# EAGLE schematic icyradio (EAGLE 9.5.1), part 2 of 2
## Sheet 10 of 10: Power
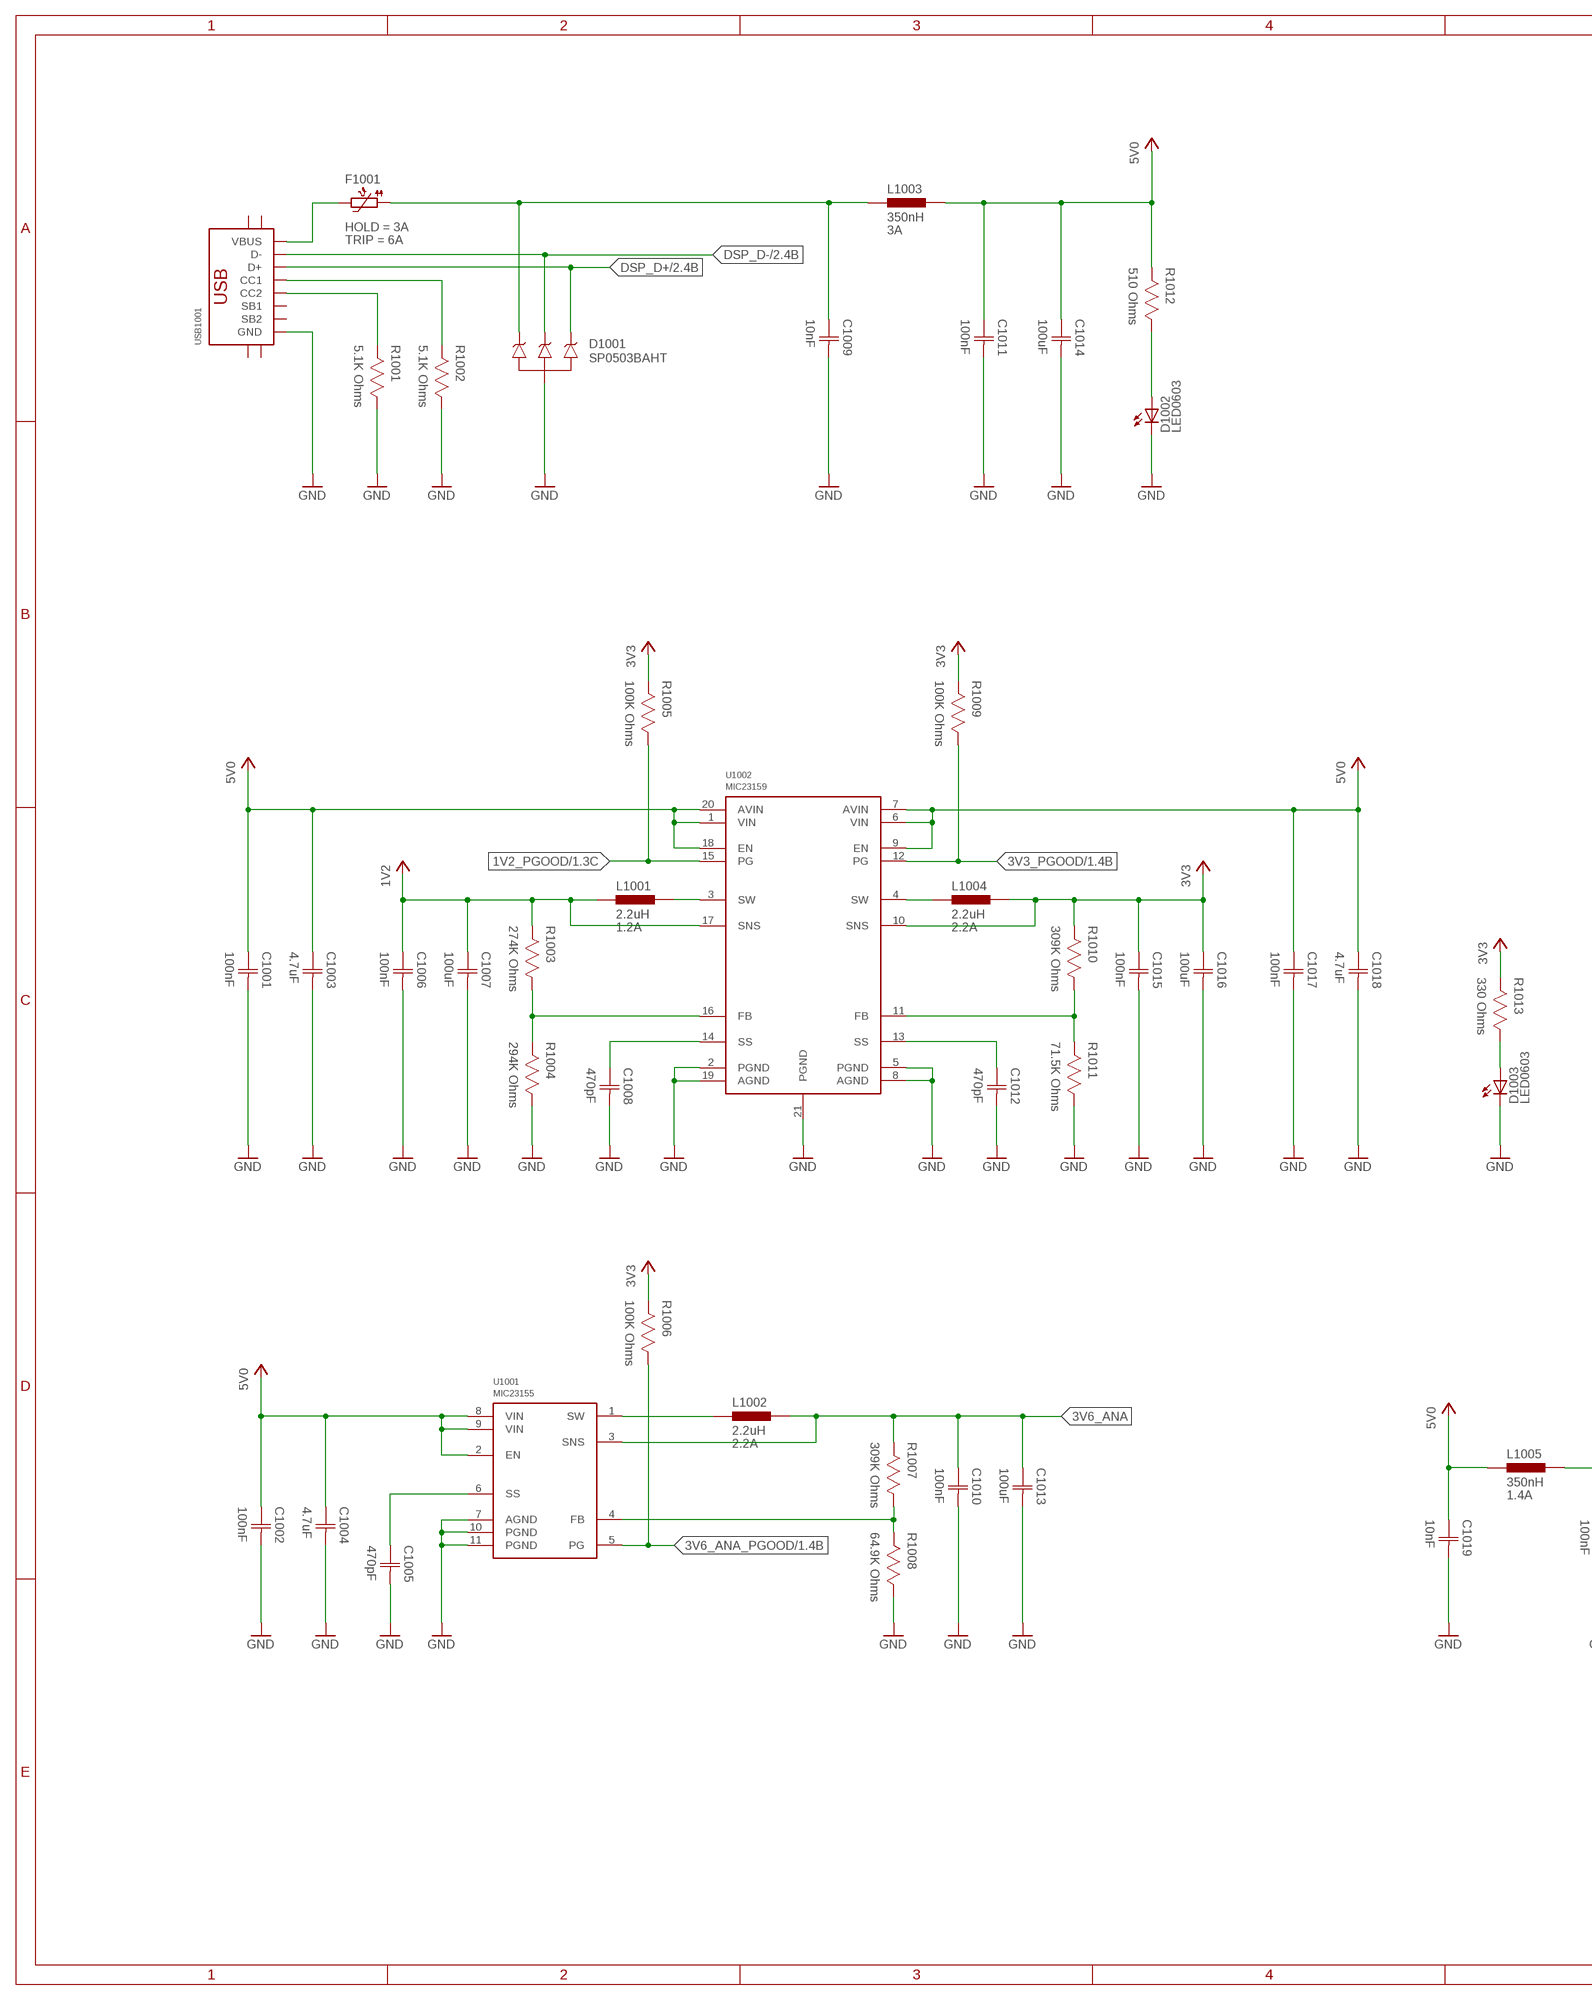
[diagram p18: schematic, sheet 10, part 1 of 2]
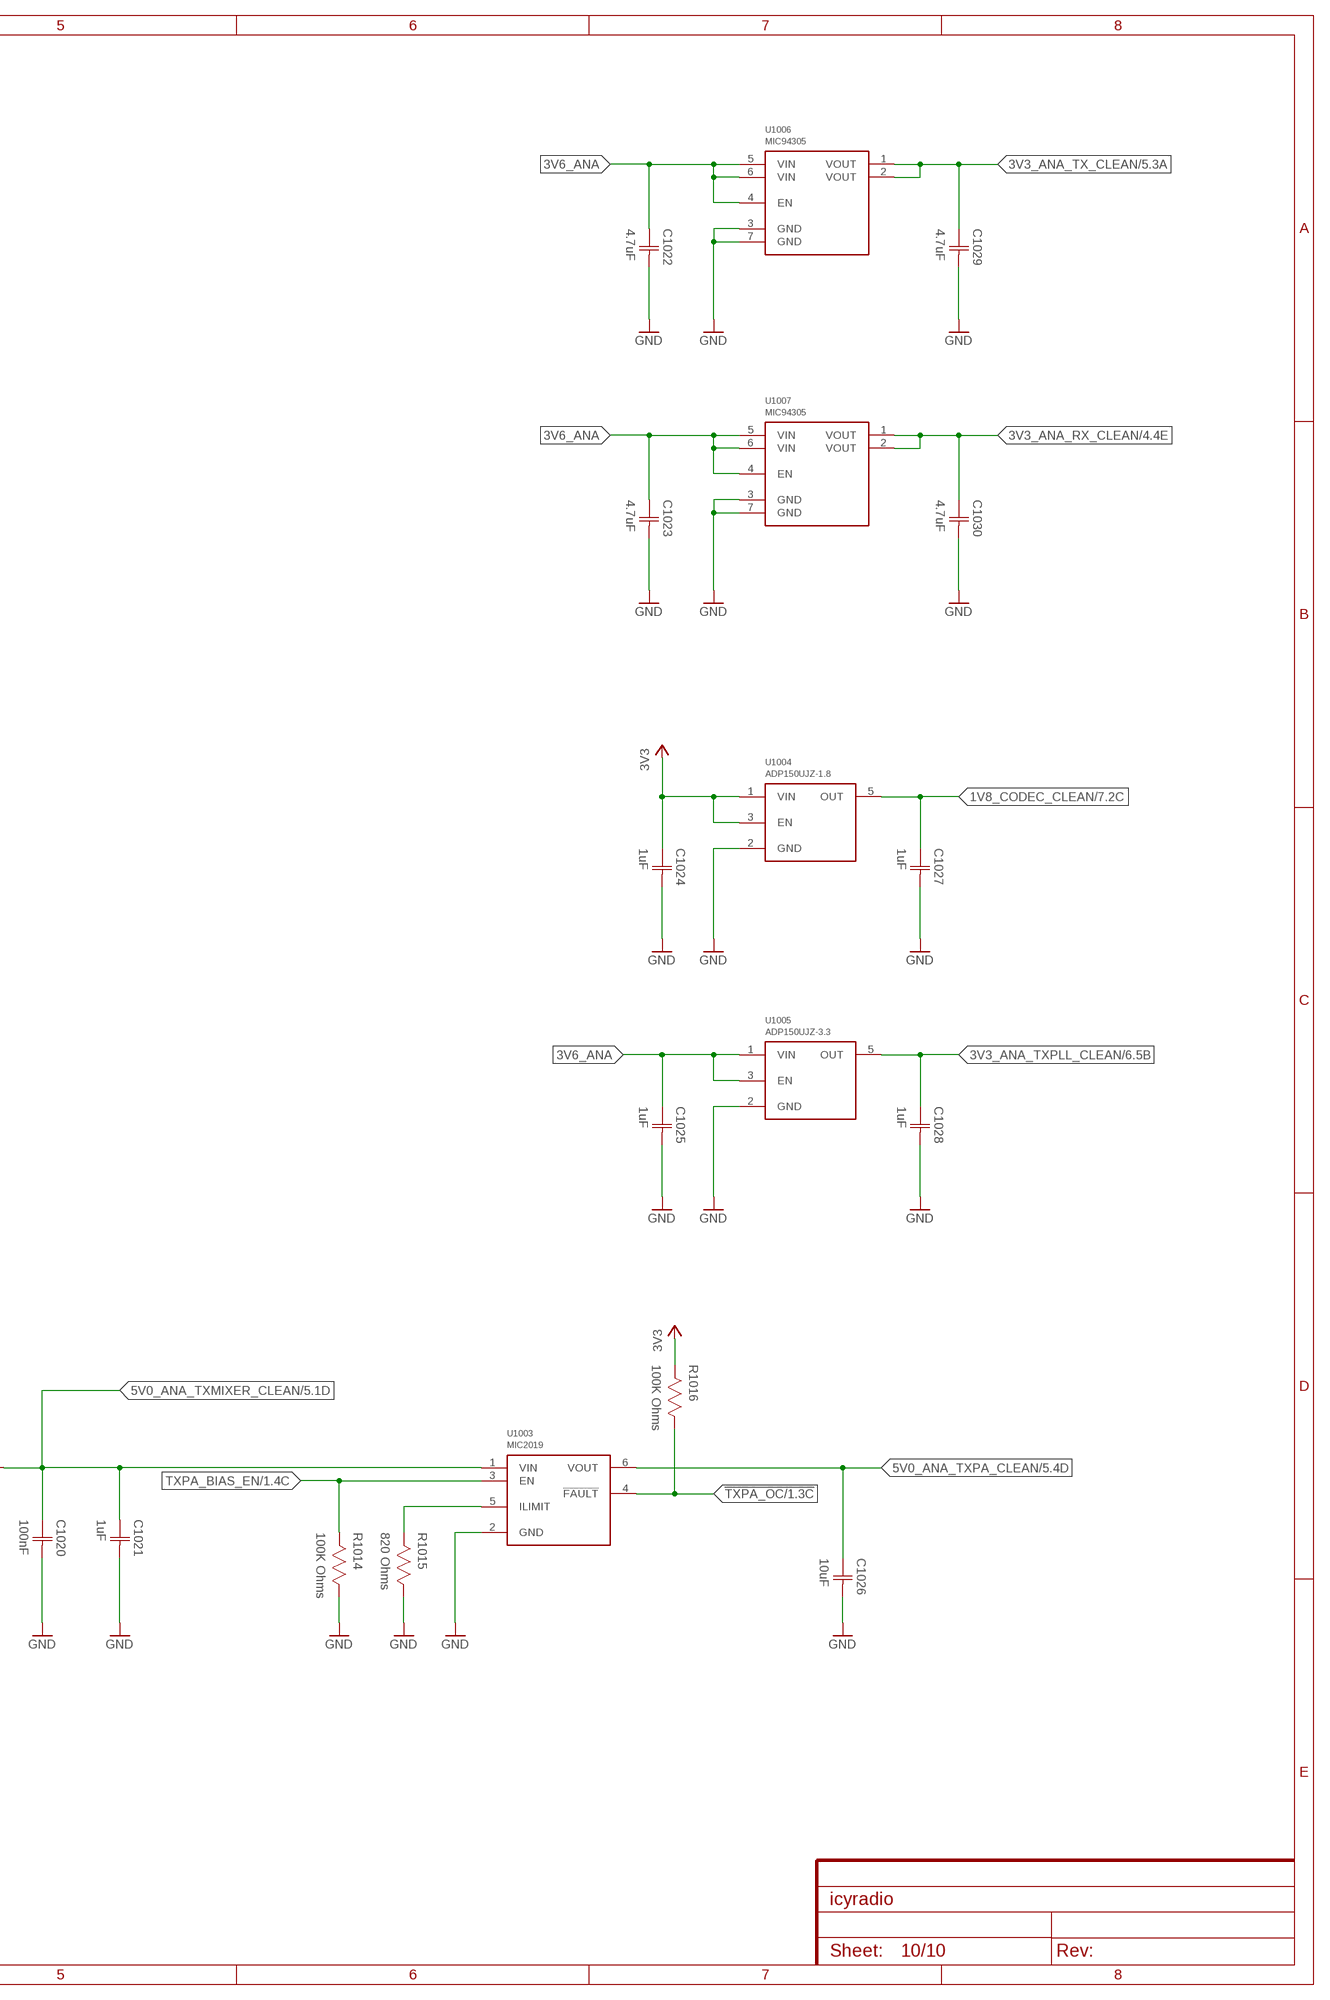
[diagram p19: schematic, sheet 10, part 2 of 2]

### Parts
C1001  100nF  CAPACITOR-0603  [CAP0603]
C1002  100nF  CAPACITOR-0603  [CAP0603]
C1003  4.7uF  CAPACITOR-0603  [CAP0603]
C1004  4.7uF  CAPACITOR-0603  [CAP0603]
C1005  470pF  CAPACITOR-0603  [CAP0603]
C1006  100nF  CAPACITOR-0603  [CAP0603]
C1007  100uF  CAPACITOR-1206  [CAP1206]
C1008  470pF  CAPACITOR-0603  [CAP0603]
C1009  10nF  CAPACITOR-0603  [CAP0603]
C1010  100nF  CAPACITOR-0603  [CAP0603]
C1011  100nF  CAPACITOR-0603  [CAP0603]
C1012  470pF  CAPACITOR-0603  [CAP0603]
C1013  100uF  CAPACITOR-1206  [CAP1206]
C1014  100uF  CAPACITOR-1206  [CAP1206]
C1015  100nF  CAPACITOR-0603  [CAP0603]
C1016  100uF  CAPACITOR-1206  [CAP1206]
C1017  100nF  CAPACITOR-0603  [CAP0603]
C1018  4.7uF  CAPACITOR-0603  [CAP0603]
C1019  10nF  CAPACITOR-0603  [CAP0603]
C1020  100nF  CAPACITOR-0603  [CAP0603]
C1021  1uF  CAPACITOR-0603  [CAP0603]
C1022  4.7uF  CAPACITOR-0603  [CAP0603]
C1023  4.7uF  CAPACITOR-0603  [CAP0603]
C1024  1uF  CAPACITOR-0603  [CAP0603]
C1025  1uF  CAPACITOR-0603  [CAP0603]
C1026  10uF  CAPACITOR-0603  [CAP0603]
C1027  1uF  CAPACITOR-0603  [CAP0603]
C1028  1uF  CAPACITOR-0603  [CAP0603]
C1029  4.7uF  CAPACITOR-0603  [CAP0603]
C1030  4.7uF  CAPACITOR-0603  [CAP0603]
D1001  SP0503BAHT  [SOT143]
D1002  LED0603  [0603]
D1003  LED0603  [0603]
F1001  PTC1206  [1206]
L1001  2.2uH  INDUCTOR-0805  [IND0805]
L1002  2.2uH  INDUCTOR-2.5X2X1.2MM  [IND2520]
L1003  350nH  INDUCTOR-0805  [IND0805]
L1004  2.2uH  INDUCTOR-2.5X2X1.2MM  [IND2520]
L1005  350nH  INDUCTOR-0603  [IND0603]
R1001  5.1K Ohms  RESISTOR-0603  [RES0603]
R1002  5.1K Ohms  RESISTOR-0603  [RES0603]
R1003  274K Ohms  RESISTOR-0603  [RES0603]
R1004  294K Ohms  RESISTOR-0603  [RES0603]
R1005  100K Ohms  RESISTOR-0603  [RES0603]
R1006  100K Ohms  RESISTOR-0603  [RES0603]
R1007  309K Ohms  RESISTOR-0603  [RES0603]
R1008  64.9K Ohms  RESISTOR-0603  [RES0603]
R1009  100K Ohms  RESISTOR-0603  [RES0603]
R1010  309K Ohms  RESISTOR-0603  [RES0603]
R1011  71.5K Ohms  RESISTOR-0603  [RES0603]
R1012  510 Ohms  RESISTOR-0603  [RES0603]
R1013  330 Ohms  RESISTOR-0603  [RES0603]
R1014  100K Ohms  RESISTOR-0603  [RES0603]
R1015  820 Ohms  RESISTOR-0603  [RES0603]
R1016  100K Ohms  RESISTOR-0603  [RES0603]
U1001  MIC23155  [DFN10]
U1002  MIC23159  [VQFN20]
U1003  MIC2019  [SOT23-6]
U1004  ADP150UJZ-1.8  [SOT23-5]
U1005  ADP150UJZ-3.3  [SOT23-5]
U1006  MIC94305  [DFN6]
U1007  MIC94305  [DFN6]
USB1001  USB-C-16P-SMD-FLAT-SIDE-TYPE-2  [USB-C-16P-SMD-FLAT-SIDE-TYPE-2]

### Nets
1V2: C1006.1(C1) C1007.1(C1) L1001.1 R1003.2 U1002.17(SNS) ; also sheet 3
1V2_FB: R1003.1 R1004.2 U1002.16(FB)
1V2_PGOOD: R1005.1 U1002.15(PG) ; also sheet 1
1V2_SOFTSTART: C1008.1(C1) U1002.14(SS)
1V8_CODEC_CLEAN: C1027.1(C1) U1004.5(OUT) ; also sheet 7
3V3: C1015.1(C1) C1016.1(C1) C1024.1(C1) L1004.2 R1005.2 R1006.2 R1009.2 R1010.2 R1013.2 R1016.2 U1002.10(SNS) U1004.1(VIN) U1004.3(EN) ; also sheet 1,2,3,4,5,6,7,8,9
3V3_ANA_RX_CLEAN: C1030.1(C1) U1007.1(VOUT) U1007.2(VOUT) ; also sheet 4
3V3_ANA_TX_CLEAN: C1029.1(C1) U1006.1(VOUT) U1006.2(VOUT) ; also sheet 5
3V3_ANA_TXPLL_CLEAN: C1028.1(C1) U1005.5(OUT) ; also sheet 6
3V3_FB: R1010.1 R1011.2 U1002.11(FB)
3V3_PGOOD: R1009.1 U1002.12(PG) ; also sheet 1
3V3_SOFTSTART: C1012.1(C1) U1002.13(SS)
3V6_ANA: C1010.1(C1) C1013.1(C1) C1022.1(C1) C1023.1(C1) C1025.1(C1) L1002.2 R1007.2 U1001.3(SNS) U1005.1(VIN) U1005.3(EN) U1006.4(EN) U1006.5(VIN) U1006.6(VIN) U1007.4(EN) U1007.5(VIN) U1007.6(VIN)
3V6_ANA_FB: R1007.1 R1008.2 U1001.4(FB)
3V6_ANA_PGOOD: R1006.1 U1001.5(PG) ; also sheet 1
3V6_ANA_SOFTSTART: C1005.1(C1) U1001.6(SS)
5V0: C1001.1(C1) C1002.1(C1) C1003.1(C1) C1004.1(C1) C1011.1(C1) C1014.1(C1) C1017.1(C1) C1018.1(C1) C1019.1(C1) L1003.2 L1005.1 R1012.2 U1001.2(EN) U1001.8(VIN) U1001.9(VIN) U1002.1(VIN) U1002.6(VIN) U1002.7(AVIN) U1002.9(EN) U1002.18(EN) U1002.20(AVIN)
5V0_ANA_TXMIXER_CLEAN: C1020.1(C1) C1021.1(C1) L1005.2 U1003.1(VIN) ; also sheet 5
5V0_ANA_TXPA_CLEAN: C1026.1(C1) U1003.6(VOUT) ; also sheet 5
!TXPA_OC: R1016.1 U1003.4(!FAULT) ; also sheet 1
DSP_D+: D1001.4 USB1001.A6(D+) USB1001.B6(D+) ; also sheet 2
DSP_D-: D1001.3 USB1001.A7(D-) USB1001.B7(D-) ; also sheet 2
GND: C1001.2(C2) C1002.2(C2) C1003.2(C2) C1004.2(C2) C1005.2(C2) C1006.2(C2) C1007.2(C2) C1008.2(C2) C1009.2(C2) C1010.2(C2) C1011.2(C2) C1012.2(C2) C1013.2(C2) C1014.2(C2) C1015.2(C2) C1016.2(C2) C1017.2(C2) C1018.2(C2) C1019.2(C2) C1020.2(C2) C1021.2(C2) C1022.2(C2) C1023.2(C2) C1024.2(C2) C1025.2(C2) C1026.2(C2) C1027.2(C2) C1028.2(C2) C1029.2(C2) C1030.2(C2) D1001.1 D1002.1(C) D1003.1(C) R1001.1 R1002.1 R1004.1 R1008.1 R1011.1 R1014.1 R1015.1 U1001.7(AGND) U1001.10(PGND) U1001.11(PGND) U1002.2(PGND) U1002.5(PGND) U1002.8(AGND) U1002.19(AGND) U1002.21(PGND) U1003.2(GND) U1004.2(GND) U1005.2(GND) U1006.3(GND) U1006.7(GND) U1007.3(GND) U1007.7(GND) USB1001.A1/B12(GND) USB1001.B1/A12(GND) ; also sheet 1,2,3,4,5,6,7,8,9
N$37: L1004.1 U1002.4(SW)
N$43: L1001.2 U1002.3(SW)
N$47: R1001.2 USB1001.B5(CC2)
N$49: R1002.2 USB1001.A5(CC1)
N$58: F1001.2 USB1001.A4/B9(VBUS) USB1001.B4/A9(VBUS)
N$65: L1002.1 U1001.1(SW)
N$93: C1009.1(C1) D1001.2 F1001.1 L1003.1
N$94: R1015.2 U1003.5(ILIMIT)
N$148: D1003.2(A) R1013.1
N$149: D1002.2(A) R1012.1
TXPA_BIAS_EN: R1014.2 U1003.3(EN) ; also sheet 1
Unconnected: USB1001.A8(SB1) USB1001.B8(SB2) USB1001.SHIELD@0(SHIELD) USB1001.SHIELD@1(SHIELD) USB1001.SHIELD@2(SHIELD) USB1001.SHIELD@3(SHIELD)

## Library data of the parts
C101-C111 C201-C218 C301-C319 C401-C433 C501-C528 C601-C623 C701-C726 C801 C901-C907 C1001-C1030 = Capacitor:CAPACITOR
CON301 = Generic Connector:FPC-40P
D101 D201 D501 D702 D1002 D1003 = LED:LED
D301 = LED:RGBLED
D401 = Generic Diode:BAV99; OCLCSC: C68983
D701 D1001 = TVS:SP0503BAHT
F1001 = PTC Fuses:PTC; HOLD: 3A; OCLCSC: C70170; TRIP: 6A
J701-J703 = DC Jack:TRSJACK; OCLCSC: C145813
L201 L202 = Inductor:INDUCTOR; OCMOUSER: 81-BLM18PG471SN1D
L203 = Inductor:INDUCTOR; OCLCSC: C285968
L401 L402 = Inductor:INDUCTOR; OCMOUSER: 609-L-14CR15JV4T
L403 = Inductor:INDUCTOR; OCMOUSER: 81-LQW18AN8N2D00D
L501-L509 L601-L606 L701-L706 = Inductor:INDUCTOR
L1001 = Inductor:INDUCTOR; CURRENT: 1.2A; OCLCSC: C281115
L1002 L1004 = Inductor:INDUCTOR; CURRENT: 2.2A; OCLCSC: C375952
L1003 = Inductor:INDUCTOR; CURRENT: 3A; OCMOUSER: 810-MPZ2012S221AT000
L1005 = Inductor:INDUCTOR; CURRENT: 1.4A; OCMOUSER: 81-BLM18PG221SN1D
Q801 Q802 = Alpha Omega:AO3400
R101-R106 R201-R204 R301-R305 R401-R416 R501-R516 R601-R607 R701-R716 R801-R805 R901-R909 R1001-R1016 = Resistor:RESISTOR
RFCON401 RFCON501 RFCON502 = RF Connector:RFCON
SJ201 = Solder Jumper:SJ
TC101 TC201 = TagConnect:TC2050-IDC
TP1-TP3 = PADs:TESTPOINT
TRF401 = Inductor:ETC1-1T-2TR
U101 = EFM32:EFM32GG11B4*L112
U201 = Microchip:ATSAM*
U301 = Lattice:ICE40HX8K-CT256
U302 = Microchip:SST26VF064B
U401 = Microchip:DSC121*
U402 = Analog Devices:LTC220*
U403 = Rafael Micro:R820T
U501 = Analog Devices:ADL5385
U502 = Analog Devices:AD9117
U503 = Analog Devices:ADL5601
U601 U901 = Microchip:DSC120*
U602 = Analog Devices:ADF4351
U701 = Tempo Semiconductor:TSCS25
U702 = Silicon Labs:CP2615
U801 = BuyDisplay:ER-TFT035-6
U902 = Silicon Labs:SI5351C
U1001 = Microchip:MIC23155
U1002 = Microchip:MIC23159
U1003 = Microchip:MIC20*9
U1004 U1005 = Analog Devices:ADP150*
U1006 U1007 = Microchip:MIC94305
USB701 USB1001 = USB Connector:USB-C-16P-SMD-FLAT-SIDE
X101 = Crystal:CRYSTAL; OCLCSC: C164062
X401 X901 = Crystal:CRYSTAL_4P; OCLCSC: C70562